# EAGLE design feather-power-switch-mk-1.0 (EAGLE 6.5.0)
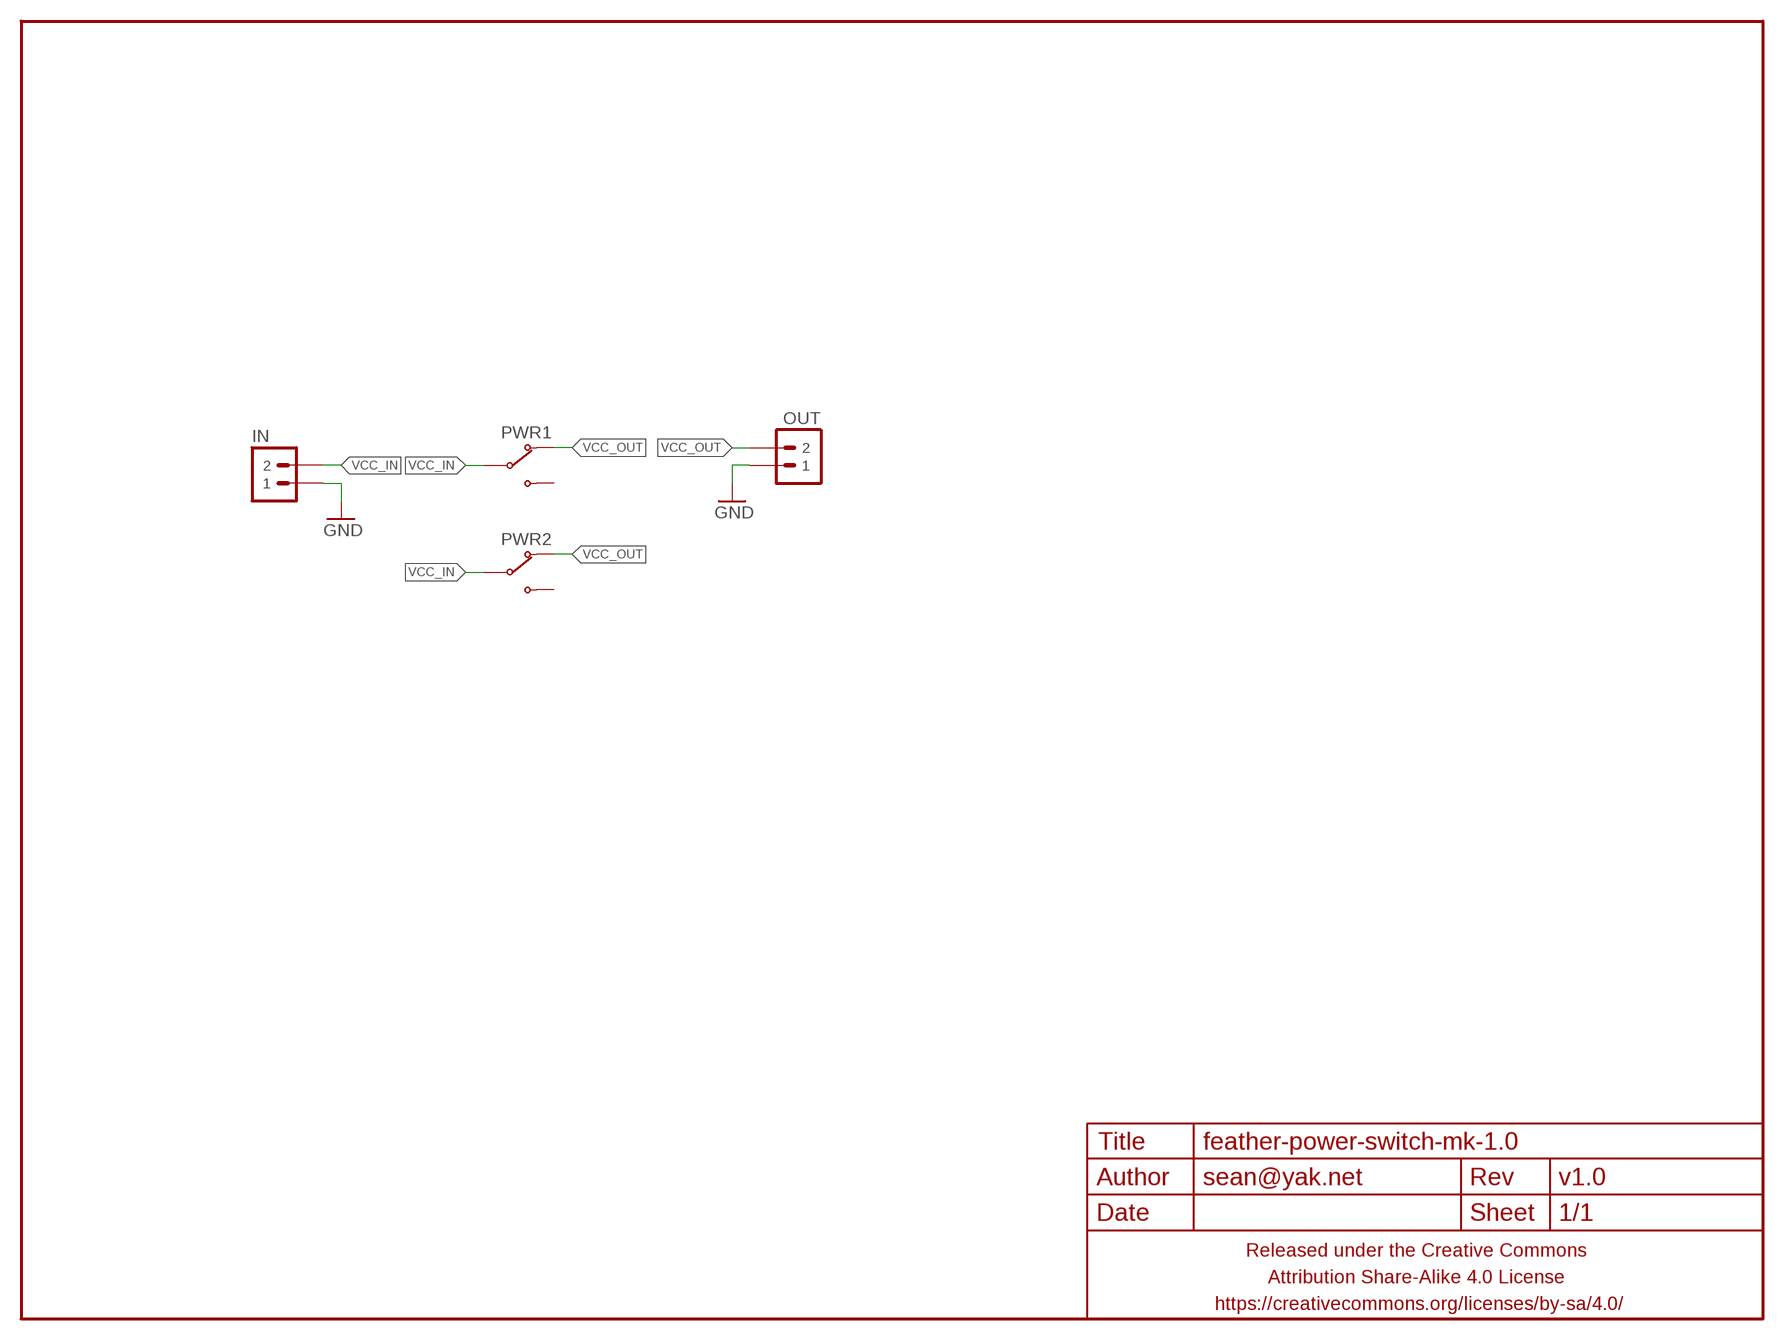
[diagram p0: schematic, sheet 1]

## Parts
FRAME1  FRAME-LETTERNO_PACKAGE  [DUMMY]
IN  M02JST-PTH-RA-R+  [JST-2-PH-RA-PTH-R+]
OUT  M02PTH-CENTERED-R+  [1X02-CENTER-R+]
PWR1  SWITCH-SPDTPCM12SMTR  [SWITCH-SPDT-SMD-RA-PCM12SMTR]
PWR2  SWITCH-SPDTPCM12SMTR  [SWITCH-SPDT-SMD-RA-PCM12SMTR]

## Nets
GND: IN.1 OUT.1
VCC_IN: IN.2 PWR1.2(COM) PWR2.2(COM)
VCC_OUT: OUT.2 PWR1.1(NC) PWR2.1(NC)
Unconnected: PWR1.3(NO) PWR2.3(NO)

## Library data of the parts
FRAME1 = A_butts:FRAME-LETTER: Schematic Frame Standard 8.5x11 US Letter frame; DESIGNER: sean@yak.net; VERSION: v1.0
IN OUT = A_butts:M02: Standard 2-pin 0.1" header. Use with - straight break away headers ( PRT-00116) - right angle break away headers (PRT-00553) - swiss pins (PRT-00743) - machine pins (PRT-00117) - female headers (PRT-00115) Molex polarized connector foot print use with: PRT-08233 with associated crimp pins and housings. 2.54_SCREWTERM for use with PRT-10571. 3.5mm Screw Terminal footprints for PRT-08084 5mm Screw Terminal footprints for use with PRT-08433
PWR1 PWR2 = A_butts:SWITCH-SPDT

## Board
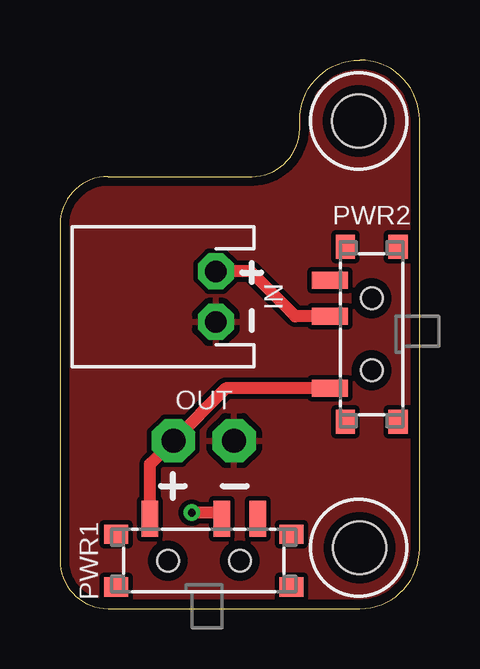
[diagram p1: board, top side]
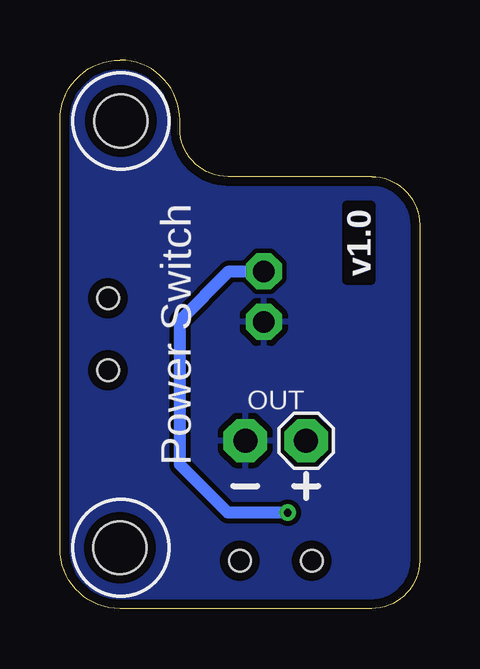
[diagram p2: board, bottom side, seen from below]

Size 15 x 22.86 mm. Coordinates in mm from the lower left corner, seen from the top.
Outline: 2,18 8,18 arc90 10,20 10,20.36 arc-90 12.5,22.86 arc-90 15,20.36 15,2.5 arc-90 12.5,0 2,0 arc-90 0,2 0,16 arc-90 2,18
Copper layers (1*16): Top 0.0356mm / dielectric 1.5011mm / Bottom 0.0356mm
Design rules "LaenPCBOrder2": minimum track width 6mil, minimum drill 13mil, track to track 6mil, track to pad 6mil, pad to pad 6mil, via to via 6mil, smd to smd 6mil, copper to edge 15mil, drill to drill 6mil, minimum pad ring 7mil, minimum via ring 7mil, stop-mask expansion 3mil, vias tented up to drill 20mil, thermal gap 10mil
Holes 2.2 mm at 12.46,20.32 12.5,2.54

### Footprints (pad centres in the part's own frame; a part is rotated, then mirrored left to right if it is on the bottom)
JST-2-PH-RA-PTH-R+ = drill 0.9 pad 1.5 octagon: 1 -1.05,0; 2 1.05,0
1X02-CENTER-R+ = drill 1 pad 1.8 octagon: 1 -1.27,0; 2 1.27,0
SWITCH-SPDT-SMD-RA-PCM12SMTR = smd 0.7 x 1.5: 1 -2.25,1.75; 2 0.75,1.75; 3 2.25,1.75 | smd 1 x 0.8: NC@1 -3.65,1.1; NC@2 -3.65,-1.1; NC@3 3.65,1.1; NC@4 3.65,-1.1 | hole 0.9: -1.5,0; 1.5,0

### Placement (x,y rotation side)
FRAME1  0,0 0 top
IN  6.5,13 90 top
OUT  6,7 0 bottom
PWR1  6,2 0 top
PWR2  13,11.43 90 top

### Tracks (layer width: path | path; a pad name or v marks a point on that pad's centre or on a via)
GND
  pour Bottom (isolate 0.2): 12.5,0 2,0 arc-90 0,2 0,16 arc-90 2,18 8,18 arc90 10,20 10,20.36 arc-90 12.5,22.86 arc-90 15,20.36 15,2.5 arc-90
  pour Top (isolate 0.2): 12.5,0 2,0 arc-90 0,2 0,16 arc-90 2,18 8,18 arc90 10,20 10,20.36 arc-90 12.5,22.86 arc-90 15,20.36 15,2.5 arc-90
VCC_IN  (via drill 0.33)
  Top 0.5: PWR1.2 6.5,4 v5.5,4 | PWR2.2 9.82,12.18 7.95,14.05 IN.2
  Bottom 0.5: v5.5,4 8,4 10,6 10,12 7.95,14.05 IN.2
VCC_OUT
  Top 0.5: PWR1.1 3.75,6.02 OUT.2 6.91,9.18 PWR2.1

### Text on the board
tPlace: OUT
bPlace: Power Switch